# Altium schematic sheet Schematic_skinbot_master_v4.SchDoc: SkinBot Master
size B; Author: Artem Dementyev; Revision: 4
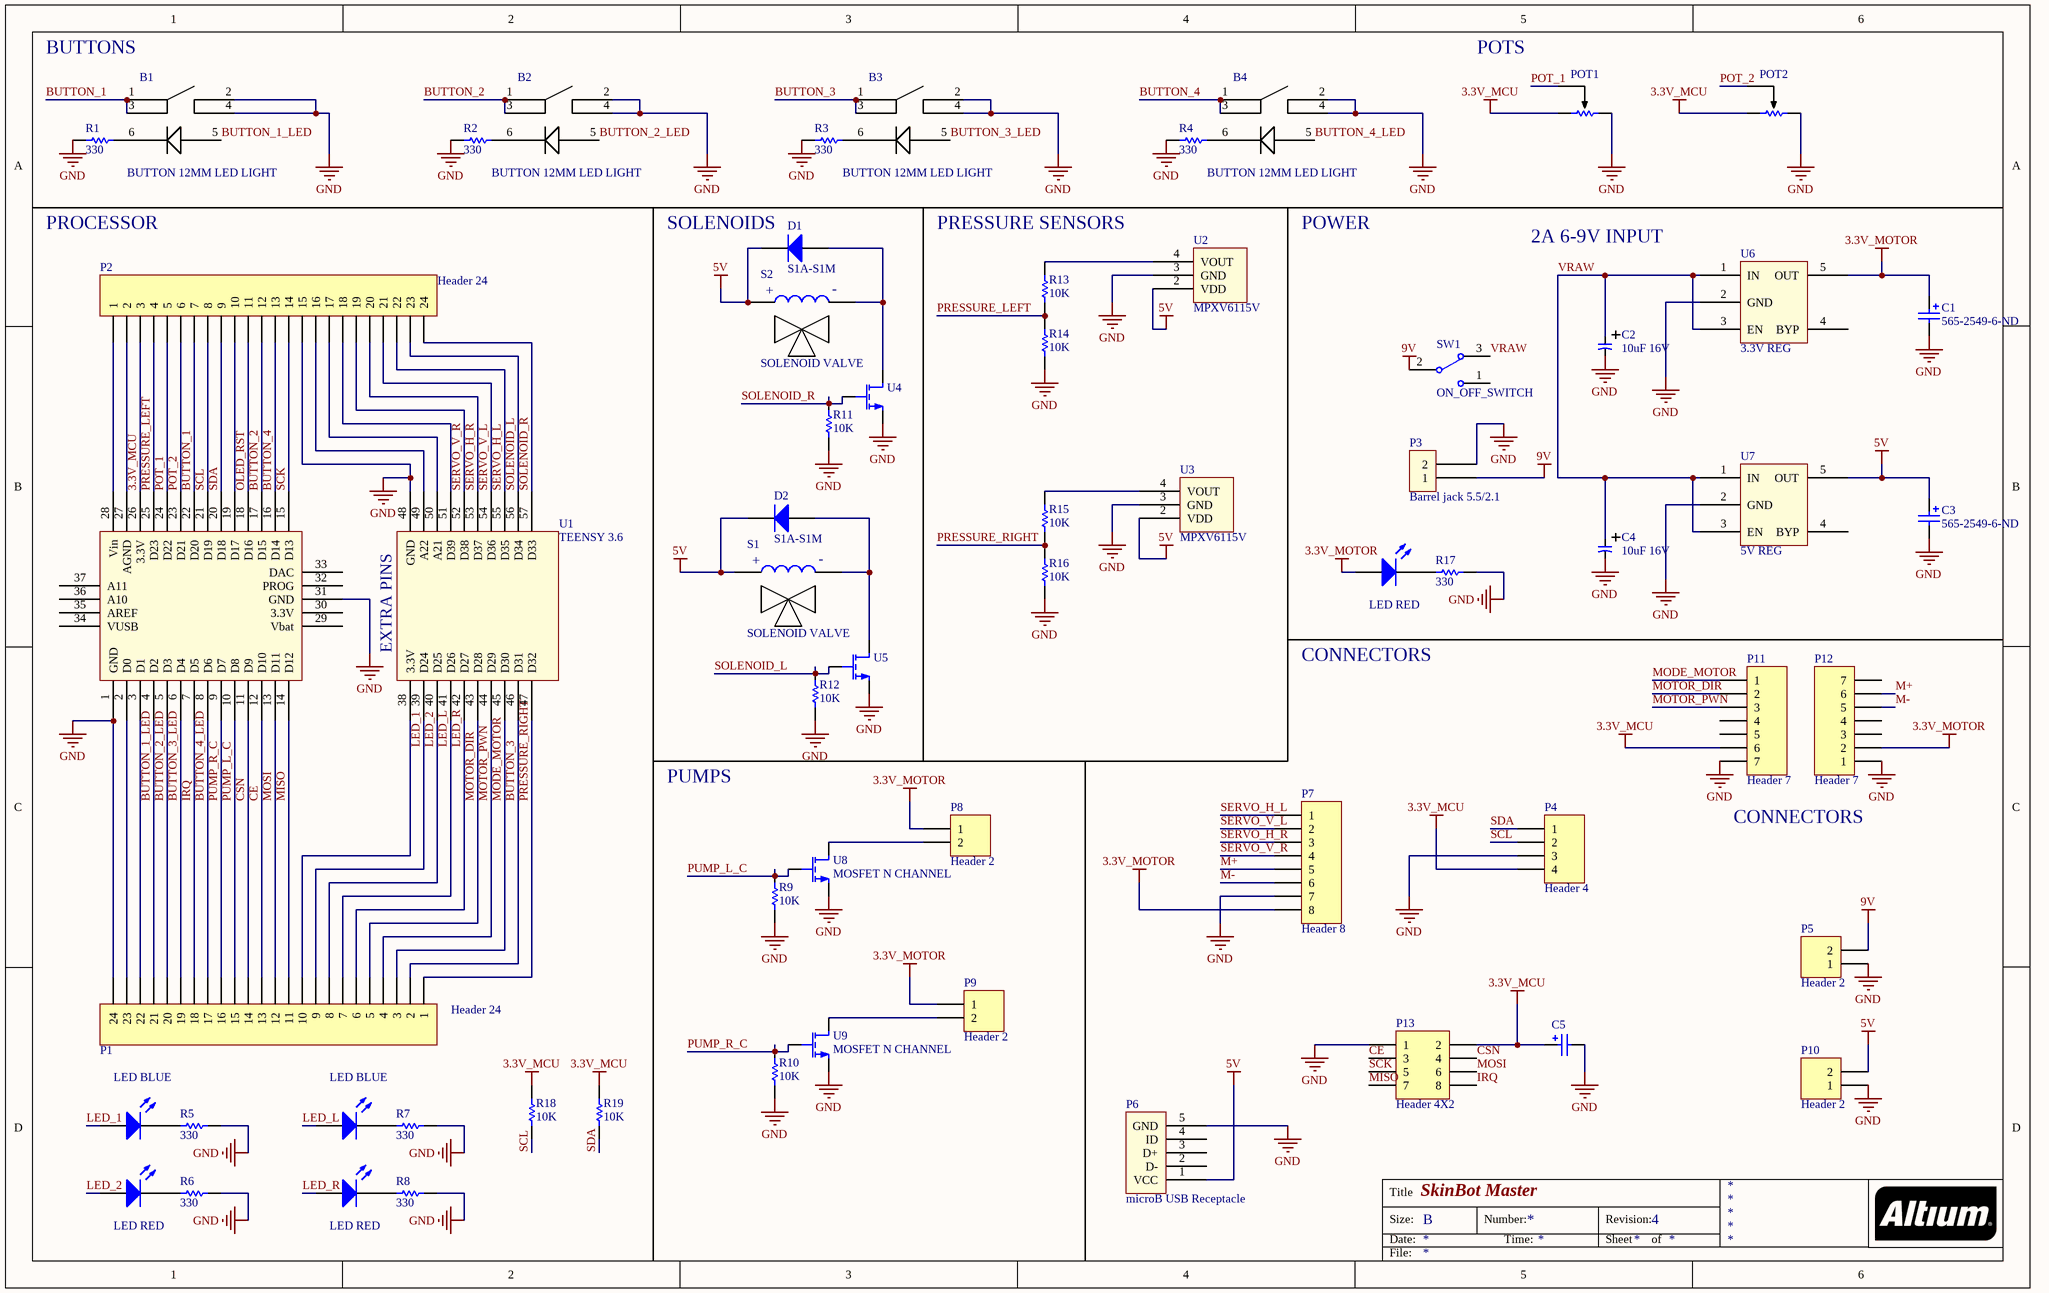
[diagram p0: Schematic_skinbot_master_v4.SchDoc]

## Parts
B1  BUTTON 12MM LED LIGHT  [12MM BUTTON LED LIGHT]
B2  BUTTON 12MM LED LIGHT  [12MM BUTTON LED LIGHT]
B3  BUTTON 12MM LED LIGHT  [12MM BUTTON LED LIGHT]
B4  BUTTON 12MM LED LIGHT  [12MM BUTTON LED LIGHT]
C1  Supplier Part Number 1: 565-2549-6-ND  [F80 Electrolytic cap]  (hidden comment: Electrolytic Cap 100uF smd)
C2  10uF 16V  [CAP0805]
C3  Supplier Part Number 1: 565-2549-6-ND  [F80 Electrolytic cap]  (hidden comment: Electrolytic Cap 100uF smd)
C4  10uF 16V  [CAP0805]
C5  Electrolytic Cap 100uF smd  [F80 Electrolytic cap]  (value not drawn)
D1  S1A-S1M  [JEDEC DO-214]
D2  S1A-S1M  [JEDEC DO-214]
LED1  LED BLUE  [0603 LED]
LED2  LED RED  [0603 LED]
LED3  LED BLUE  [0603 LED]
LED4  LED RED  [0603 LED]
LED5  LED RED  [0603 LED]
P1  Header 24  [HDR1X24]
P2  Header 24  [HDR1X24]
P3  Barrel jack 5.5/2.1  [ADC-028-2]
P4  Header 4  [HDR1X4]
P5  Header 2  [HDR1X2]
P6  microB USB Receptacle  [MicroB USB Standarad SMT]
P7  Header 8  [HDR1X8]
P8  Header 2  [HDR1X2]
P9  Header 2  [HDR1X2]
P10  Header 2  [HDR1X2]
P11  Header 7  [HDR1X7]
P12  Header 7  [HDR1X7]
P13  Header 4X2  [HDR2X4]
POT1  Potentiometer large  [PRS11S]  (value not drawn)
POT2  Potentiometer large  [PRS11S]  (value not drawn)
R1  330  [0603W]
R2  330  [0603W]
R3  330  [0603W]
R4  330  [0603W]
R5  330  [0603W]
R6  330  [0603W]
R7  330  [0603W]
R8  330  [0603W]
R9  10K  [0603W]
R10  10K  [0603W]
R11  10K  [0603W]
R12  10K  [0603W]
R13  10K  [0603W]
R14  10K  [0603W]
R15  10K  [0603W]
R16  10K  [0603W]
R17  330  [0603W]
R18  10K  [0603W]
R19  10K  [0603W]
S1  SOLENOID VALVE  [S070C-5CG-32]
S2  SOLENOID VALVE  [S070C-5CG-32]
SW1  ON_OFF_SWITCH  [SS321 Switch]
U1  TEENSY 3.6  [TEENSY 3.6]
U2  MPXV6115V  [MPXV6115V]
U3  MPXV6115V  [MPXV6115V]
U4  MOSFET N CHANNEL  [SOT323]  (value not drawn)
U5  MOSFET N CHANNEL  [SOT323]  (value not drawn)
U6  3.3V REG  [SOT-23-5]
U7  5V REG  [SOT-23-5]
U8  MOSFET N CHANNEL  [SOT323]
U9  MOSFET N CHANNEL  [SOT323]

## Nets
3.3V_MCU: C5.1 P2.3 P4.4 P11.6 P13.2 POT1.1 POT2.1 R18.1 R19.1 U1.26(3.3V)
3.3V_MOTOR: C1.1 LED5.1(A) P7.8 P8.1 P9.1 P12.2 U6.5(OUT)
5V: C3.1 D1.1(C) D2.1(C) P6.1(VCC) P10.2 S1.1(+) S2.1(+) U2.2(VDD) U3.2(VDD) U7.5(OUT)
9V: P3.1 P5.2 SW1.2
GND: B1.2 B1.4 B2.2 B2.4 B3.2 B3.4 B4.2 B4.4 C1.2 C2.2 C3.2 C4.2 C5.2 P1.24 P2.15 P3.2 P4.3 P5.1 P6.5(GND) P7.7 P10.1 P11.7 P12.1 P13.1 POT1.3 POT2.3 R1.2 R2.2 R3.2 R4.2 R5.1 R6.1 R7.1 R8.1 R9.2 R10.2 R11.2 R12.2 R14.2 R16.2 R17.1 U1.1(GND) U1.31(GND) U1.48(GND) U2.3(GND) U3.3(GND) U4.2(S) U5.2(S) U6.2(GND) U7.2(GND) U8.2(S) U9.2(S)
BUTTON_1: B1.1 B1.3 P2.7 U1.22(D20)
BUTTON_1_LED: B1.5 P1.21 U1.4(D2)
BUTTON_2: B2.1 B2.3 P2.12 U1.17(D15)
BUTTON_2_LED: B2.5 P1.20 U1.5(D3)
BUTTON_3: B3.1 B3.3 P1.2 U1.46(D31)
BUTTON_3_LED: B3.5 P1.19 U1.6(D4)
BUTTON_4: B4.1 B4.3 P2.13 U1.16(D14)
BUTTON_4_LED: B4.5 P1.17 U1.8(D6)
CE: P1.13 P13.3 U1.12(D10)
CSN: P1.14 P13.4 U1.11(D9)
IRQ: P1.18 P13.8 U1.7(D5)
LED_1: LED1.1(A) P1.9 U1.39(D24)
LED_2: LED2.1(A) P1.8 U1.40(D25)
LED_L: LED3.1(A) P1.7 U1.41(D26)
LED_R: LED4.1(A) P1.6 U1.42(D27)
M+: P7.5 P12.6
M-: P7.6 P12.5
MISO: P1.11 P13.7 U1.14(D12)
MODE_MOTOR: P1.3 P11.1 U1.45(D30)
MOSI: P1.12 P13.6 U1.13(D11)
MOTOR_DIR: P1.5 P11.2 U1.43(D28)
MOTOR_PWN: P1.4 P11.3 U1.44(D29)
OLED_RST: P2.11 U1.18(D16)
POT_1: P2.5 POT1.2 U1.24(D22)
POT_2: P2.6 POT2.2 U1.23(D21)
PRESSURE_LEFT: P2.4 R13.2 R14.1 U1.25(D23)
PRESSURE_RIGHT: P1.1 R15.2 R16.1 U1.47(D32)
PUMP_L_C: P1.15 R9.1 U1.10(D8) U8.1(G)
PUMP_R_C: P1.16 R10.1 U1.9(D7) U9.1(G)
SCK: P2.14 P13.5 U1.15(D13)
SCL: P2.8 P4.2 R18.2 U1.21(D19)
SDA: P2.9 P4.1 R19.2 U1.20(D18)
SERVO_H_L: P2.22 P7.1 U1.55(D35)
SERVO_H_R: P2.20 P7.3 U1.53(D37)
SERVO_V_L: P2.21 P7.2 U1.54(D36)
SERVO_V_R: P2.19 P7.4 U1.52(D38)
SOLENOID_L: P2.23 R12.1 U1.56(D34) U5.1(G)
SOLENOID_R: P2.24 R11.1 U1.57(D33) U4.1(G)
VRAW: C2.1 C4.1 SW1.3 U6.1(IN) U6.3(EN) U7.1(IN) U7.3(EN)
NetB1_6: B1.6 R1.1
NetB2_6: B2.6 R2.1
NetB3_6: B3.6 R3.1
NetB4_6: B4.6 R4.1
NetD1_2: D1.2(A) S2.2(-) U4.3(D)
NetD2_2: D2.2(A) S1.2(-) U5.3(D)
NetLED1_2: LED1.2(K) R5.2
NetLED2_2: LED2.2(K) R6.2
NetLED3_2: LED3.2(K) R7.2
NetLED4_2: LED4.2(K) R8.2
NetLED5_2: LED5.2(K) R17.2
NetP1_10: P1.10 U1.38(3.3V)
NetP1_22: P1.22 U1.3(D1)
NetP1_23: P1.23 U1.2(D0)
NetP2_1: P2.1 U1.28(Vin)
NetP2_2: P2.2 U1.27(AGND)
NetP2_10: P2.10 U1.19(D17)
NetP2_16: P2.16 U1.49(A22)
NetP2_17: P2.17 U1.50(A21)
NetP2_18: P2.18 U1.51(D39)
NetP8_2: P8.2 U8.3(D)
NetP9_2: P9.2 U9.3(D)
NetR13_1: R13.1 U2.4(VOUT)
NetR15_1: R15.1 U3.4(VOUT)

Not connected (* = marked no-connect by the designer): P6 2(D-) 3(D+) 4(ID); P11 4 5; P12 3 4 7; SW1 1; U1 29(Vbat) 30(3.3V) 32(PROG) 33(DAC) 34(VUSB) 35(AREF) 36(A10) 37(A11); U6 4(BYP); U7 4(BYP)

## Notes on the sheet
- (near B1) BUTTONS
- POTS
- PROCESSOR
- (near D1) SOLENOIDS
- (near R13) PRESSURE SENSORS
- POWER
- 2A 6-9V INPUT
- CONNECTORS
- PUMPS
- Title
- Size:
- Date:
- B
- Number:
- Time:
- Revision:
- Sheet
- of
- File:
- (in symbol TEENSY 3.6) EXTRA PINS

## Library data of the parts
C1 C3 C5 = Electrolytic Cap 100uF smd: 100uF 25 VSMD; manufacturer: United Chemi-Con; manufacturer part number: EMZA250ADA101MF80G; digikey part number: 565-2549-1-ND
  C1 C3: Supplier 1: Digikey
C2 C4 = Polarized Cap
D1 D2 = S1A-S1M: General purpose diode 50V 1A SMA; Supplier 1: Digikey; Supplier Part Number 1: ES1AFSCT-ND
LED1-LED5 = LED: LED SMD 1206/0603; Supplier 1: Digikey
  LED1 LED3: Supplier Part Number 1: LNJ947W8CRACT-ND
  LED2 LED4 LED5: Supplier Part Number 1: LNJ247W82RACT-ND
P1 P2 = Header 24: Header, 24-Pin; LatestRevisionDate: 17-Jul-2002; LatestRevisionNote: Re-released for DXP Platform.; Publisher: Altium Limited
P3 = Barrel jack 5.5/2.1: sparkfun part number: 12748
P4 = Header 4: Header, 4-Pin; LatestRevisionDate: 17-Jul-2002; LatestRevisionNote: Re-released for DXP Platform.; Publisher: Altium Limited
P5 P8-P10 = Header 2: Header, 2-Pin; LatestRevisionDate: 17-Jul-2002; LatestRevisionNote: Re-released for DXP Platform.; Publisher: Altium Limited
P6 = microB USB Receptacle: Manufacturer: ZX62-B-5PA(11); Digikey: H11634CT-ND; digikey part number 2: 609-4613-1-ND
P7 = Header 8: Header, 8-Pin; LatestRevisionDate: 17-Jul-2002; LatestRevisionNote: Re-released for DXP Platform.; Publisher: Altium Limited
P11 P12 = Header 7: Header, 7-Pin; LatestRevisionDate: 17-Jul-2002; LatestRevisionNote: Re-released for DXP Platform.; Publisher: Altium Limited
P13 = Header 4X2: Header, 4-Pin, Dual row; LatestRevisionDate: 17-Jul-2002; LatestRevisionNote: Re-released for DXP Platform.; Publisher: Altium Limited
POT1 POT2 = Potentiometer large: SMD Large pot for audio; Supplier 1: Digikey; Supplier Part Number 1: PRS11S-N20F-103B1-ND
R1-R19 = Resistor: Supplier 1: Digikey
  R1-R8 R17: digikey number: RMCF0603FT10K0CT-ND; Supplier Part Number 1: 311-330JRCT-ND
  R9-R16 R18 R19: Supplier Part Number 1: 311-10KJRCT-ND
SW1 = ON_OFF_SWITCH: SPDT SMD Side Switch; Sparkfun#: COM-00597; digikey number: 563-1102-1-ND
U2 U3 = MPXV6115V: Vacuum pressure sensor -115kPa; Supplier 1: Digikey; Supplier Part Number 1: MPXV6115VC6U-ND
U6 U7 = MIC5205_VOLTAGE_REG: 5V LDO SMD; digikey number: 576-2770-1-ND
U4 U5 U8 U9 = MOSFET N CHANNEL: digikey part number: 1727-4793-1-ND